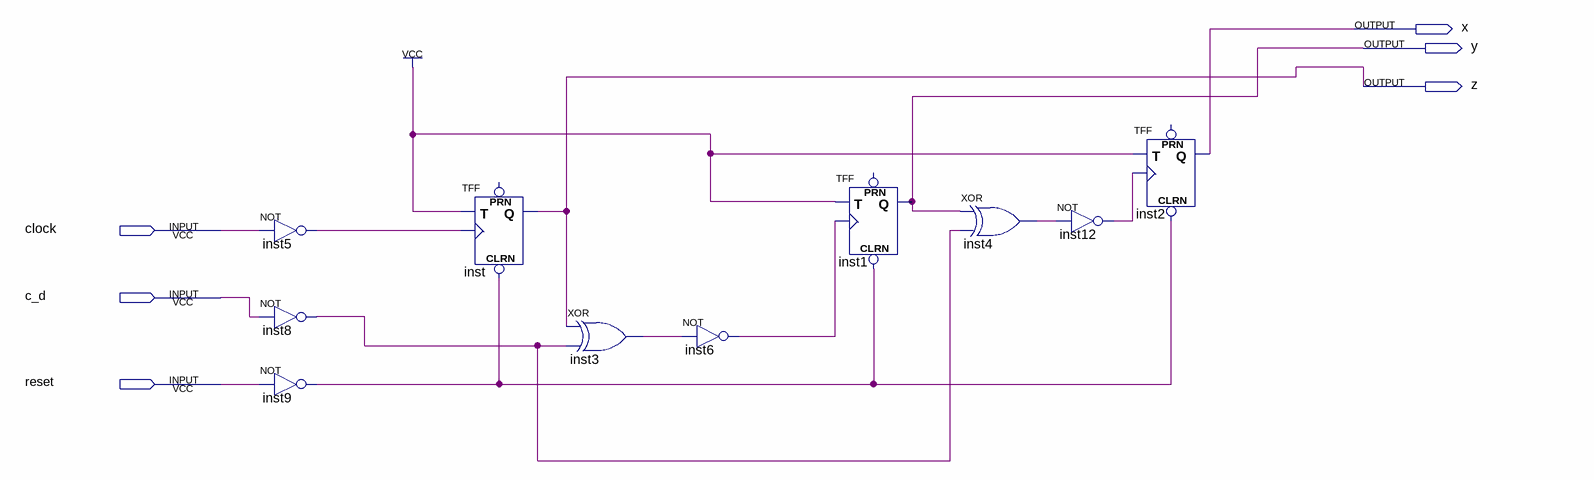
[diagram p0: schematic sheet]
// Quartus schematic contadorascresdec.bdf as structural Verilog: 10 symbols, 6 pins
module contadorascresdec (
  input  clock,
  input  c_d,
  input  reset,
  output x,
  output y,
  output z
);

  wire inst3_out, inst4_out, inst5_out, inst6_out, inst8_out, inst9_out, inst12_out;

  not inst5 (inst5_out, clock);
  not inst8 (inst8_out, c_d);
  not inst9 (inst9_out, reset);
  TFF inst (.CLRN(inst9_out), .T(1'b1), .CLK(inst5_out), .Q(z));  // open: PRN
  xor inst3 (inst3_out, z, inst8_out);
  not inst6 (inst6_out, inst3_out);
  TFF inst1 (.CLRN(inst9_out), .T(1'b1), .CLK(inst6_out), .Q(y));  // open: PRN
  xor inst4 (inst4_out, y, inst8_out);
  not inst12 (inst12_out, inst4_out);
  TFF inst2 (.CLRN(inst9_out), .T(1'b1), .CLK(inst12_out), .Q(x));  // open: PRN
endmodule
